# EAGLE design WirelessI2cController (EAGLE 6.6.0)

## Sheet 1 of 6: USB interface
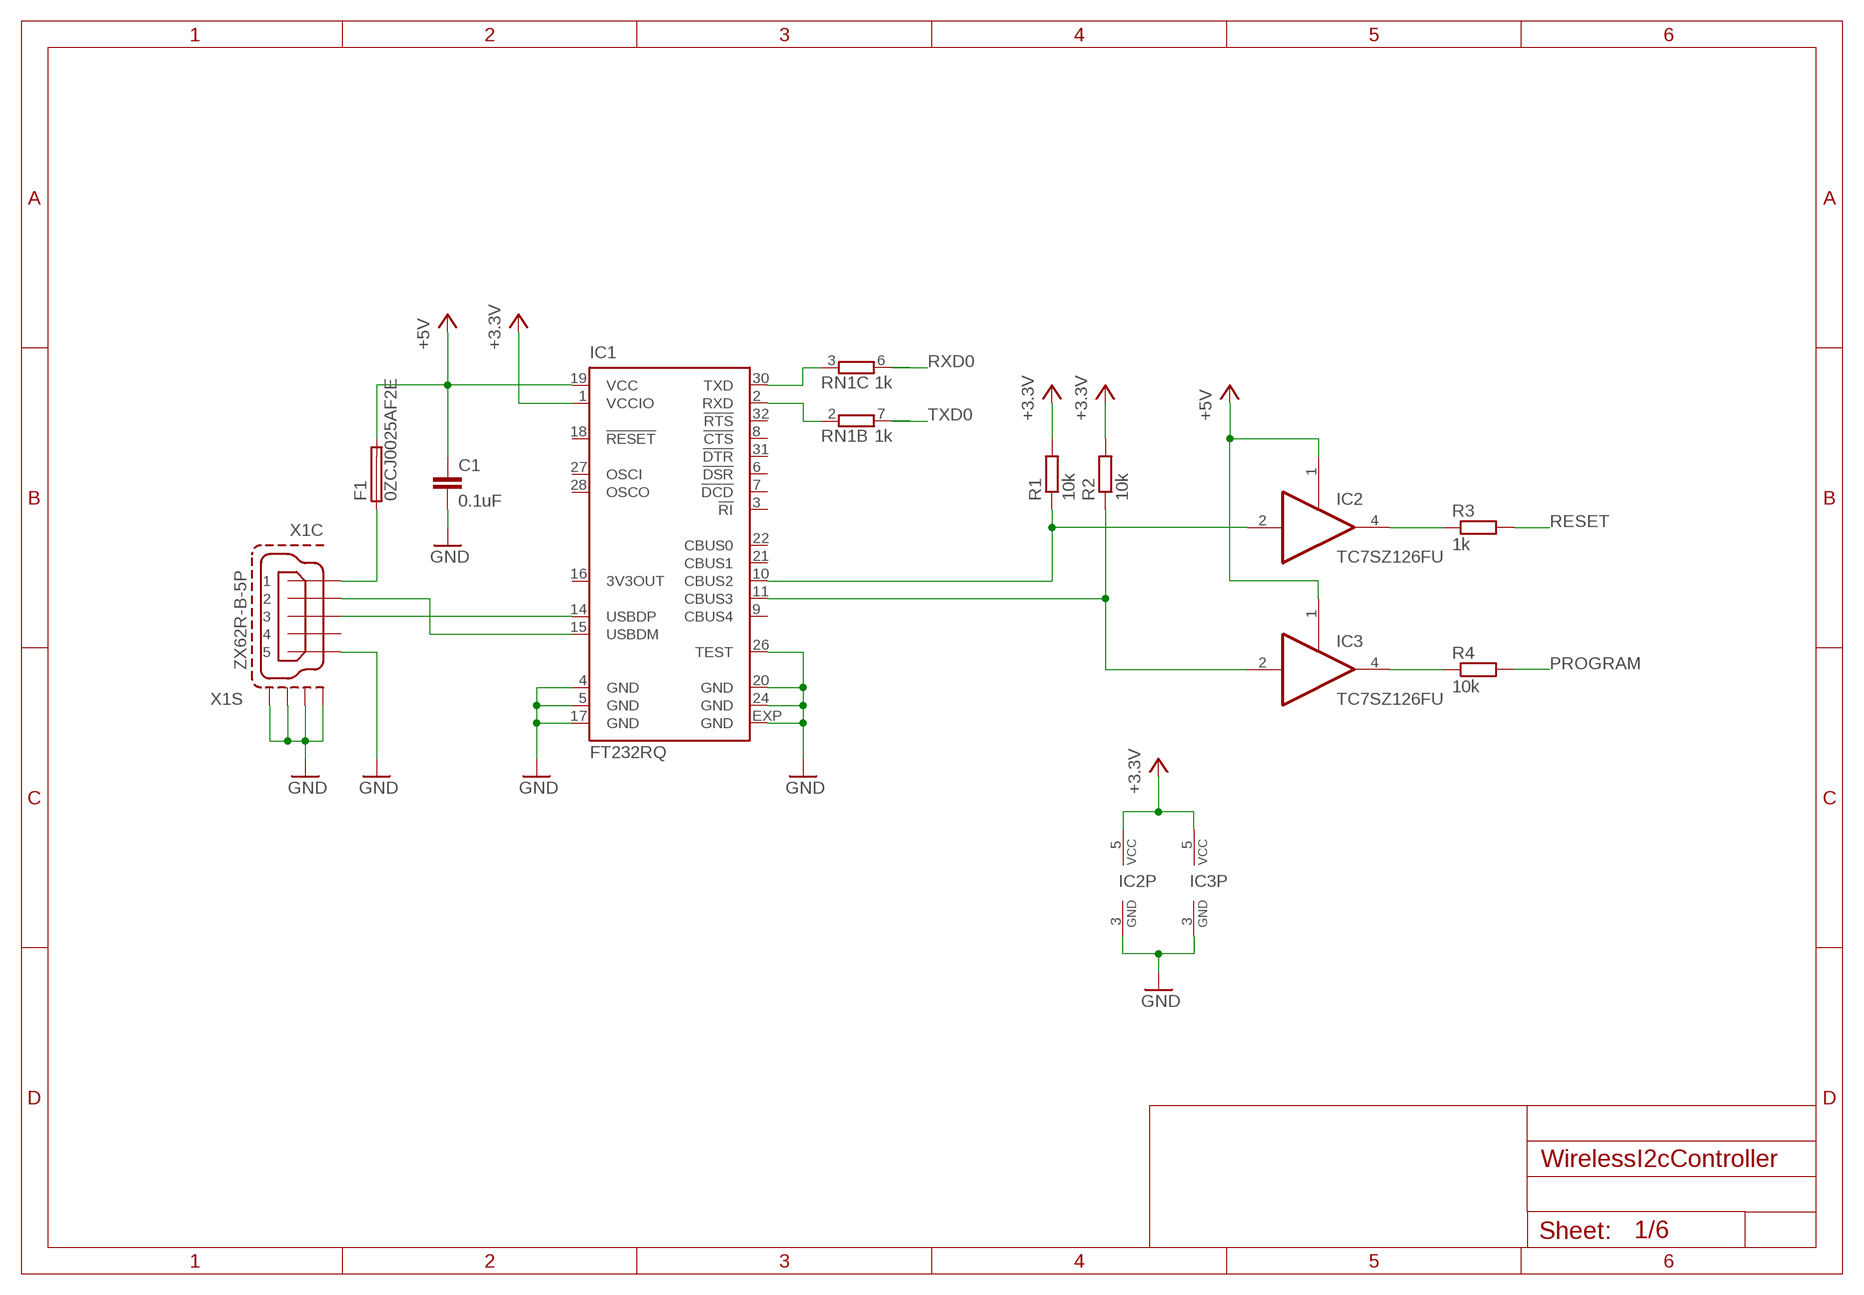
[diagram p0: schematic, sheet 1]

### Parts
C1  0.1uF  C-EUC0402  [C0402]
F1  0ZCJ0025AF2E  [0ZCJ]
IC1  FT232RQ  [QFN32]
IC2  TC7SZ126FU  74LVC1G126DCK  [SC70-5]
IC3  TC7SZ126FU  74LVC1G126DCK  [SC70-5]
R1  10k  R-EU_R0402  [R0402]
R2  10k  R-EU_R0402  [R0402]
R3  1k  R-EU_R0402  [R0402]
R4  10k  R-EU_R0402  [R0402]
RN1  1k  4R-NEXB38V  [EXB38V]
X1  ZX62R-B-5P  [ZX62R-B-5P]

### Nets
+3.3V: IC1.1(VCCIO) IC2.5(VCC) IC3.5(VCC) R1.2 R2.2 ; also sheet 2,3,4,5
+5V: C1.1 F1.2 IC1.19(VCC) IC2.1(OE) IC3.1(OE)
GND: C1.2 IC1.4(GND) IC1.5(GND) IC1.17(GND) IC1.20(GND) IC1.24(GND) IC1.26(TEST) IC1.EXP(GND) IC2.3(GND) IC3.3(GND) X1.5 X1.S1(S:S1) X1.S2(S:S2) X1.S3(S:S3) X1.S4(S:S4) ; also sheet 2,3,4,5,6
N$4: IC1.14(USBDP) X1.3
N$5: IC1.15(USBDM) X1.2
N$9: F1.1 X1.1
N$10: IC1.10(CBUS2) IC2.2(I) R1.1
N$11: IC1.11(CBUS3) IC3.2(I) R2.1
N$12: IC2.4(O) R3.1
N$13: IC3.4(O) R4.1
N$42: IC1.30(TXD) RN1.3
N$43: IC1.2(RXD) RN1.2
PROGRAM: R4.2 ; also sheet 2
RESET: R3.2 ; also sheet 2
RXD0: RN1.6 ; also sheet 2
TXD0: RN1.7 ; also sheet 2
Unconnected: IC1.3(!RI) IC1.6(!DSR) IC1.7(!DCD) IC1.8(!CTS) IC1.9(CBUS4) IC1.16(3V3OUT) IC1.18(!RESET) IC1.21(CBUS1) IC1.22(CBUS0) IC1.27(OSCI) IC1.28(OSCO) IC1.31(!DTR) IC1.32(!RTS) RN1.1 RN1.4 RN1.5 RN1.8 X1.4

## Sheet 2 of 6: 2.4GHz Wireless controller
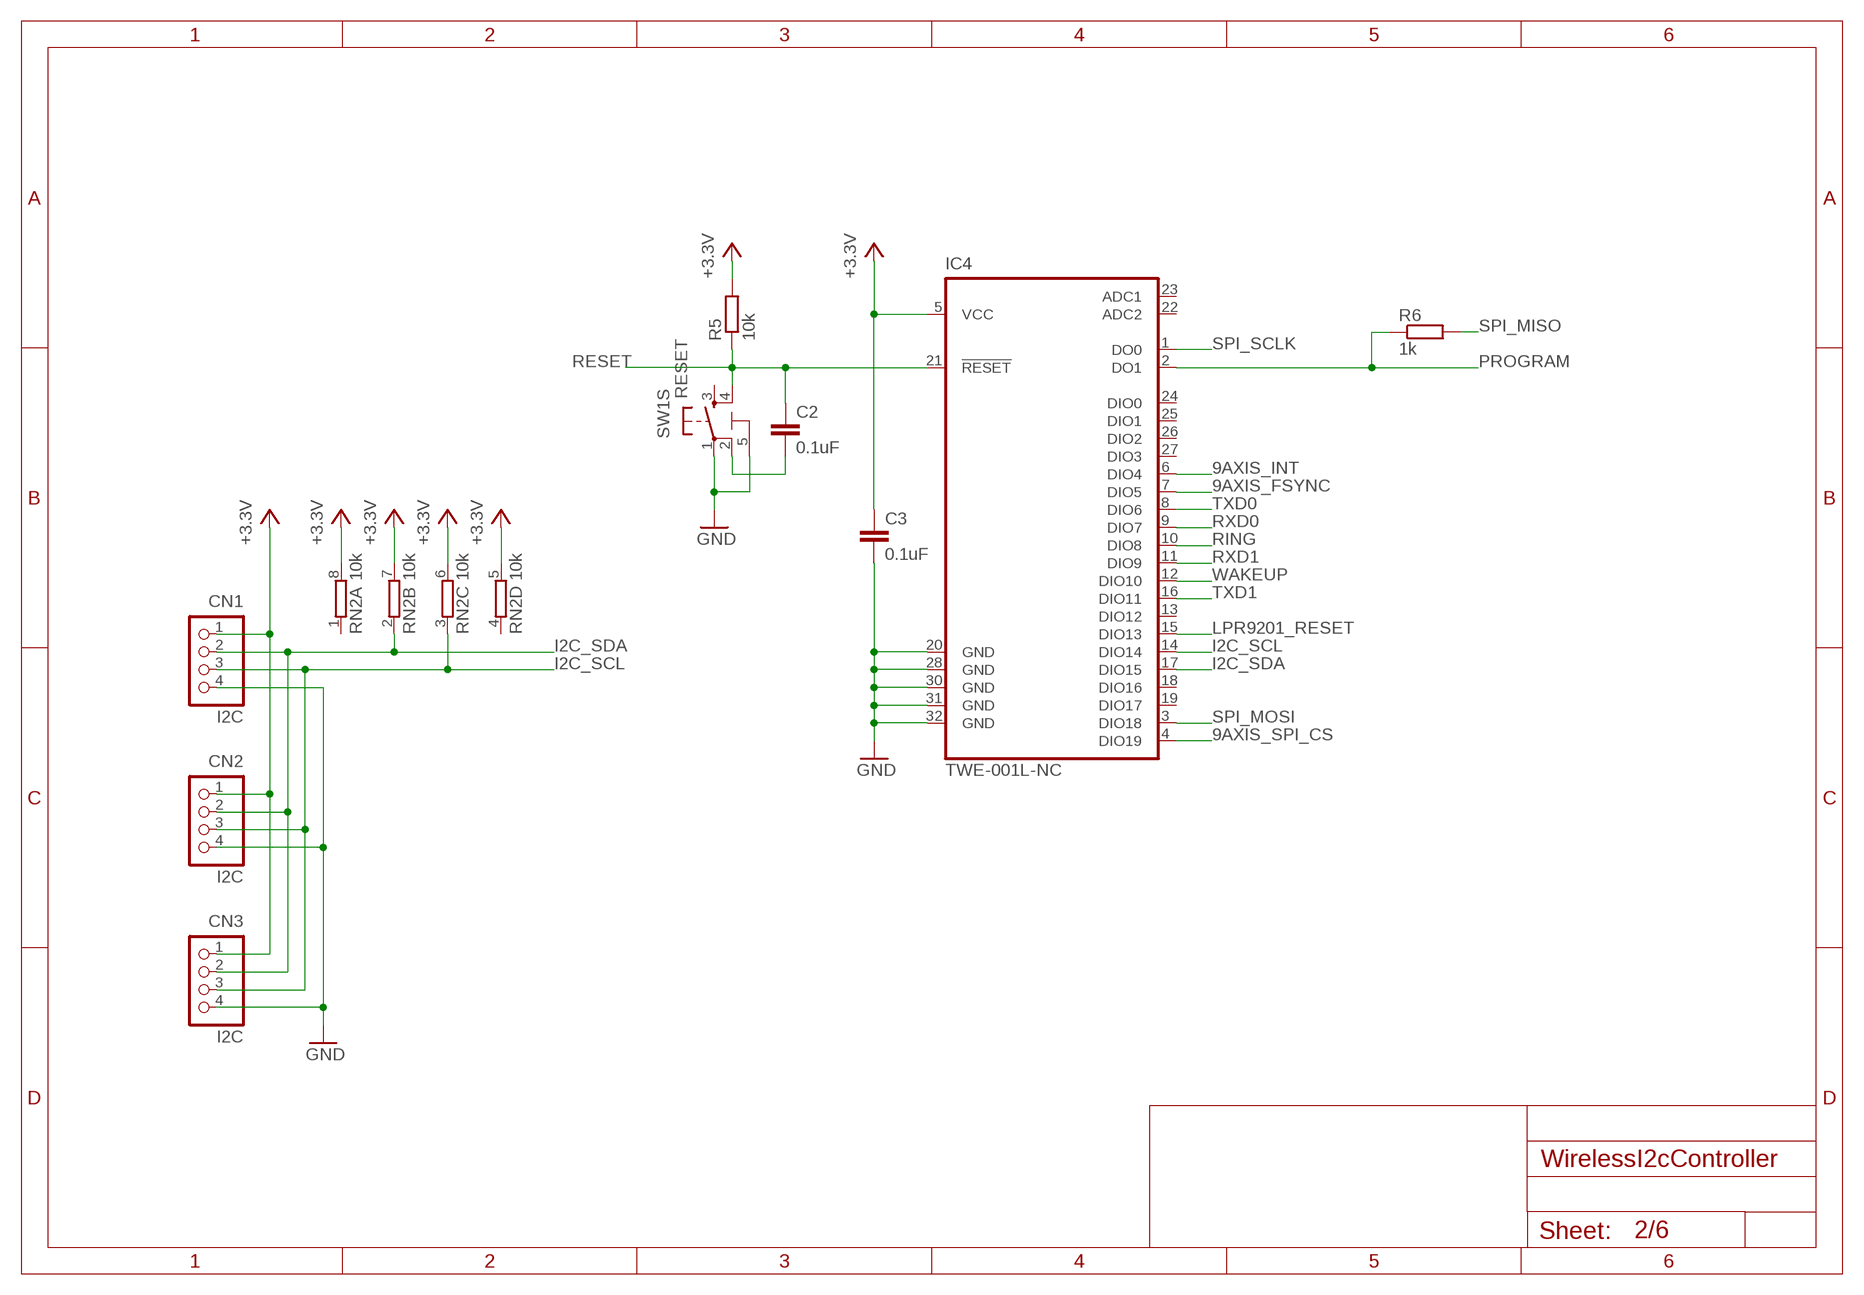
[diagram p1: schematic, sheet 2]

### Parts
C2  0.1uF  C-EUC0402  [C0402]
C3  0.1uF  C-EUC0402  [C0402]
CN1  I2C  B4B-PH-K-S  [B4B-PH-K-S]
CN2  I2C  B4B-PH-K-S  [B4B-PH-K-S]
CN3  I2C  B4B-PH-K-S  [B4B-PH-K-S]
IC4  TWE-001L-NC  [QFN32-HOLE]
R5  10k  R-EU_R0402  [R0402]
R6  1k  R-EU_R0402  [R0402]
RN2  10k  4R-NEXB38V  [EXB38V]
SW1  RESET  KMR241G  [KMR2*G*]

### Nets
9AXIS_FSYNC: IC4.7(DIO5) ; also sheet 4
9AXIS_INT: IC4.6(DIO4) ; also sheet 4
9AXIS_SPI_CS: IC4.4(DIO19) ; also sheet 4
+3.3V: C3.1 CN1.1 CN2.1 CN3.1 IC4.5(VCC) R5.2 RN2.5 RN2.6 RN2.7 RN2.8 ; also sheet 1,3,4,5
GND: C3.2 CN1.4 CN2.4 CN3.4 IC4.20(GND) IC4.28(GND) IC4.30(GND) IC4.31(GND) IC4.32(GND) SW1.1(S:P) SW1.5 ; also sheet 1,3,4,5,6
I2C_SCL: CN1.3 CN2.3 CN3.3 IC4.14(DIO14) RN2.3 ; also sheet 4
I2C_SDA: CN1.2 CN2.2 CN3.2 IC4.17(DIO15) RN2.2 ; also sheet 4
LPR9201_RESET: IC4.15(DIO13) ; also sheet 3
N$6: C2.2 SW1.2(S:P1)
PROGRAM: IC4.2(DO1) R6.1 ; also sheet 1
RESET: C2.1 IC4.21(!RESET) R5.1 SW1.4(S:S1) ; also sheet 1
RING: IC4.10(DIO8) ; also sheet 3
RXD0: IC4.9(DIO7) ; also sheet 1
RXD1: IC4.11(DIO9) ; also sheet 3
SPI_MISO: R6.2 ; also sheet 4
SPI_MOSI: IC4.3(DIO18) ; also sheet 4
SPI_SCLK: IC4.1(DO0) ; also sheet 4
TXD0: IC4.8(DIO6) ; also sheet 1
TXD1: IC4.16(DIO11) ; also sheet 3
WAKEUP: IC4.12(DIO10) ; also sheet 3
Unconnected: IC4.13(DIO12) IC4.18(DIO16) IC4.19(DIO17) IC4.22(ADC2) IC4.23(ADC1) IC4.24(DIO0) IC4.25(DIO1) IC4.26(DIO2) IC4.27(DIO3) RN2.1 RN2.4 SW1.3(S:S)

## Sheet 3 of 6: 920MHz Wireless controller
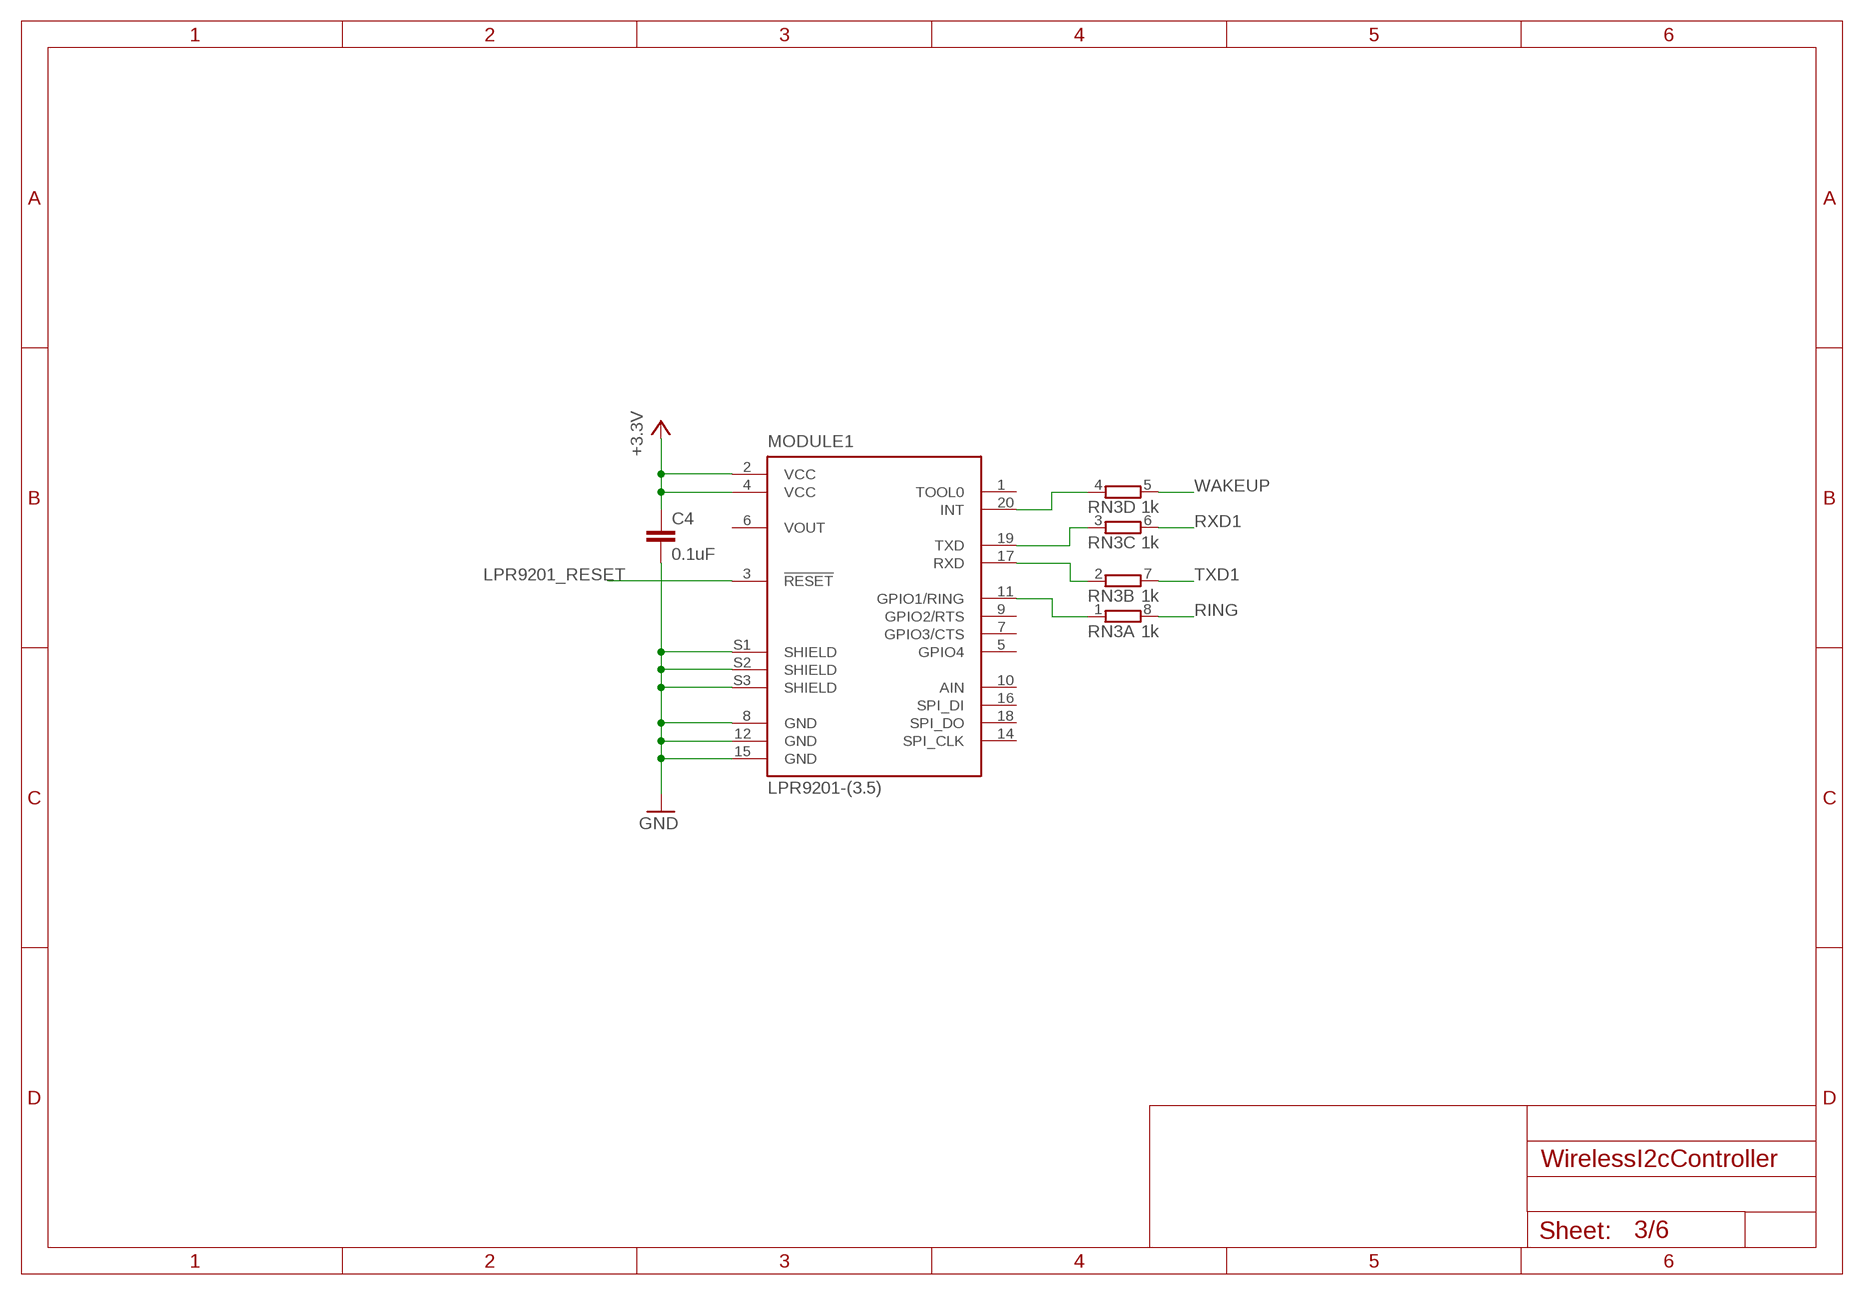
[diagram p2: schematic, sheet 3]

### Parts
C4  0.1uF  C-EUC0402  [C0402]
MODULE1  LPR9201-(3.5)  [DF12(*)-20DP-0.5V]
RN3  1k  4R-NEXB38V  [EXB38V]

### Nets
+3.3V: C4.1 MODULE1.2(VCC) MODULE1.4(VCC) ; also sheet 1,2,4,5
GND: C4.2 MODULE1.8(GND) MODULE1.12(GND) MODULE1.15(GND) MODULE1.S1(SHIELD) MODULE1.S2(SHIELD) MODULE1.S3(SHIELD) ; also sheet 1,2,4,5,6
LPR9201_RESET: MODULE1.3(!RESET) ; also sheet 2
N$3: MODULE1.19(TXD) RN3.3
N$7: MODULE1.17(RXD) RN3.2
N$16: MODULE1.20(INT) RN3.4
N$17: MODULE1.11(GPIO1/RING) RN3.1
RING: RN3.8 ; also sheet 2
RXD1: RN3.6 ; also sheet 2
TXD1: RN3.7 ; also sheet 2
WAKEUP: RN3.5 ; also sheet 2
Unconnected: MODULE1.1(TOOL0) MODULE1.5(GPIO4) MODULE1.6(VOUT) MODULE1.7(GPIO3/CTS) MODULE1.9(GPIO2/RTS) MODULE1.10(AIN) MODULE1.14(SPI_CLK) MODULE1.16(SPI_DI) MODULE1.18(SPI_DO)

## Sheet 4 of 6: Sensor
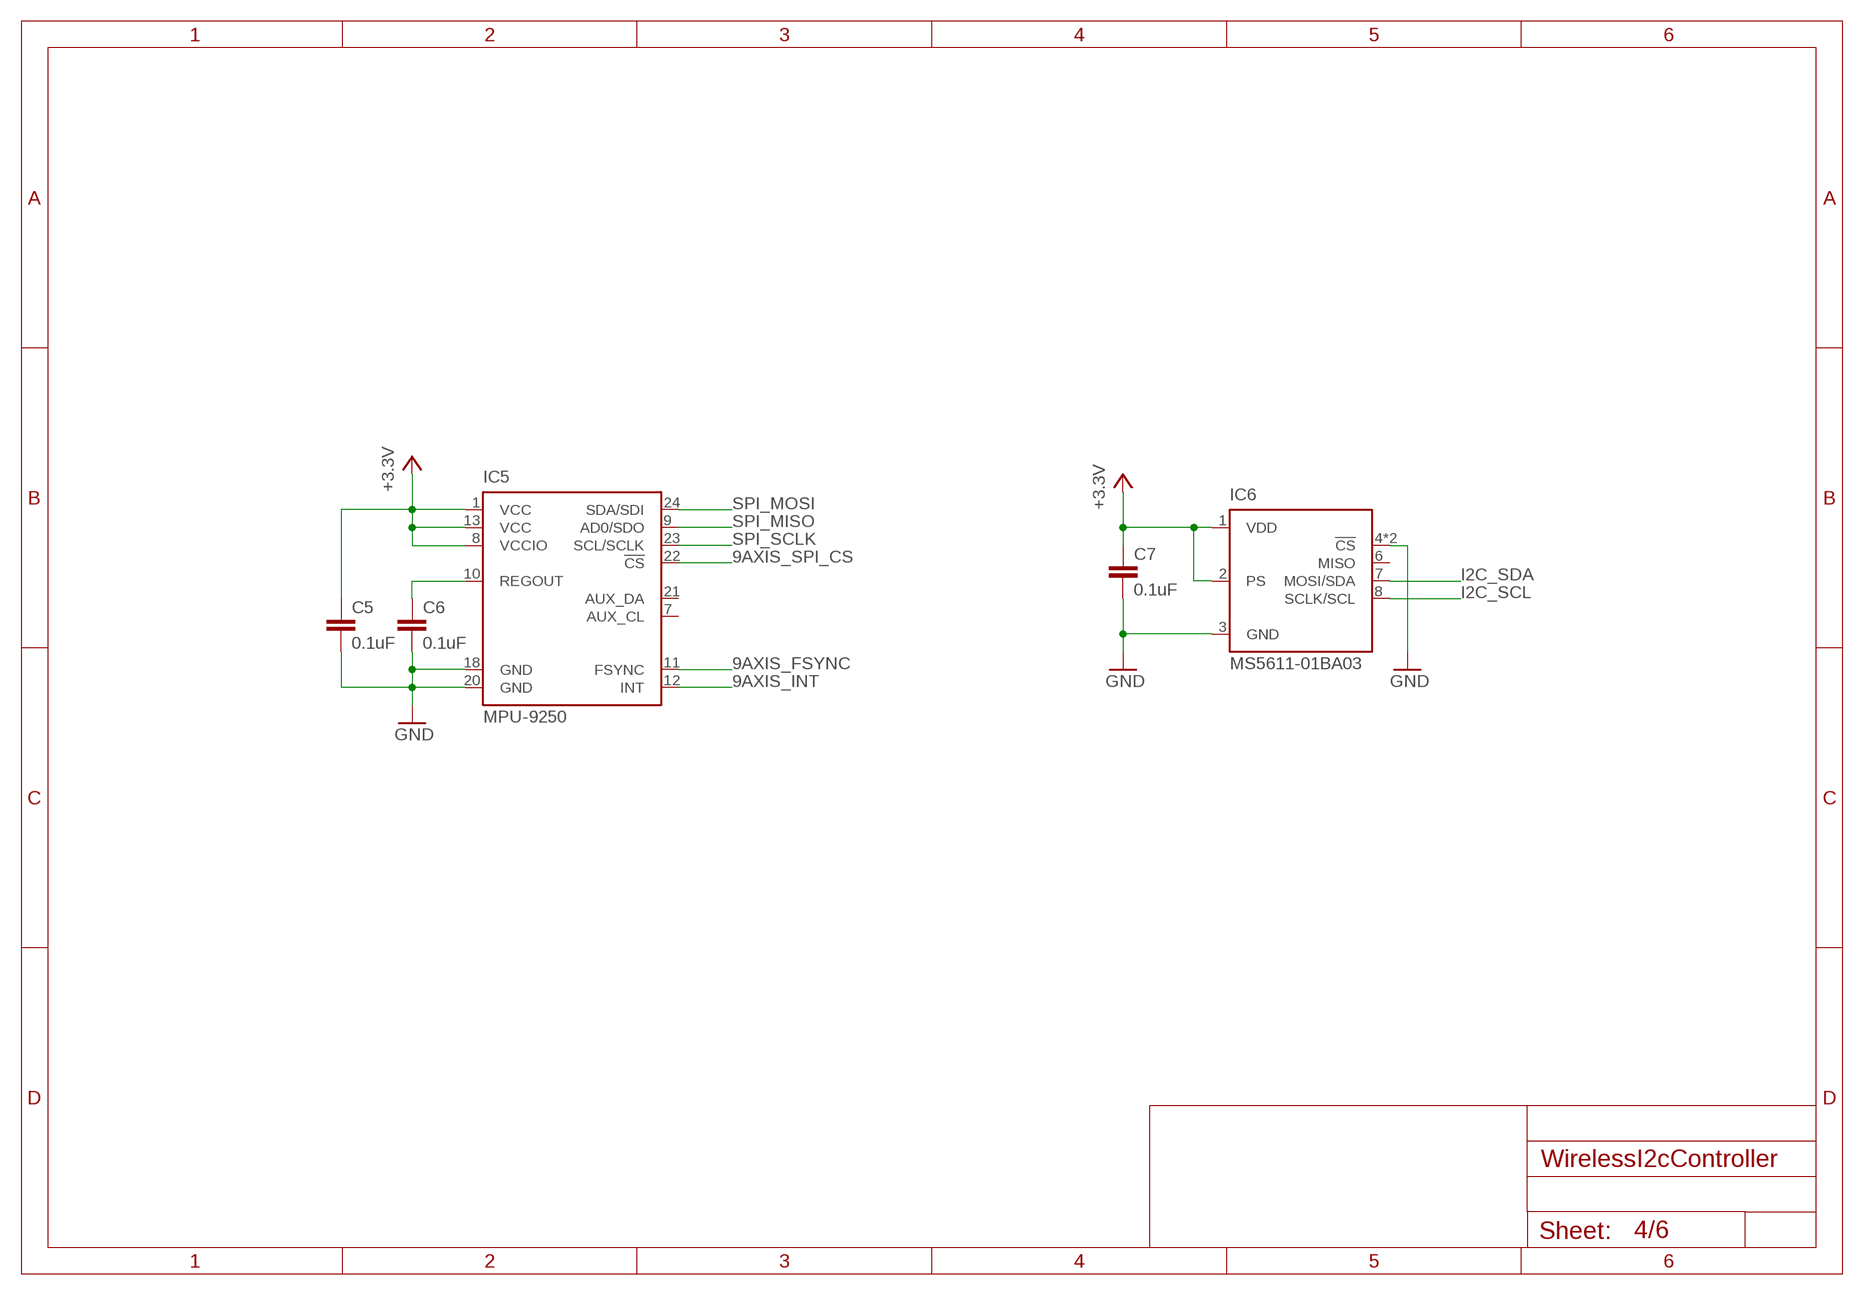
[diagram p3: schematic, sheet 4]

### Parts
C5  0.1uF  C-EUC0402  [C0402]
C6  0.1uF  C-EUC0402  [C0402]
C7  0.1uF  C-EUC0402  [C0402]
IC5  MPU-9250  [QFN24-SMALL]
IC6  MS5611-01BA03  [LGA8]

### Nets
9AXIS_FSYNC: IC5.11(FSYNC) ; also sheet 2
9AXIS_INT: IC5.12(INT) ; also sheet 2
9AXIS_SPI_CS: IC5.22(!CS) ; also sheet 2
+3.3V: C5.1 C7.1 IC5.1(VCC) IC5.8(VCCIO) IC5.13(VCC) IC6.1(VDD) IC6.2(PS) ; also sheet 1,2,3,5
GND: C5.2 C6.2 C7.2 IC5.18(GND) IC5.20(GND) IC6.3(GND) IC6.4(!CS!) IC6.5(!CS!) ; also sheet 1,2,3,5,6
I2C_SCL: IC6.8(SCLK/SCL) ; also sheet 2
I2C_SDA: IC6.7(MOSI/SDA) ; also sheet 2
N$1: C6.1 IC5.10(REGOUT)
SPI_MISO: IC5.9(AD0/SDO) ; also sheet 2
SPI_MOSI: IC5.24(SDA/SDI) ; also sheet 2
SPI_SCLK: IC5.23(SCL/SCLK) ; also sheet 2
Unconnected: IC5.7(AUX_CL) IC5.21(AUX_DA) IC6.6(MISO)

## Sheet 5 of 6: Power Supply
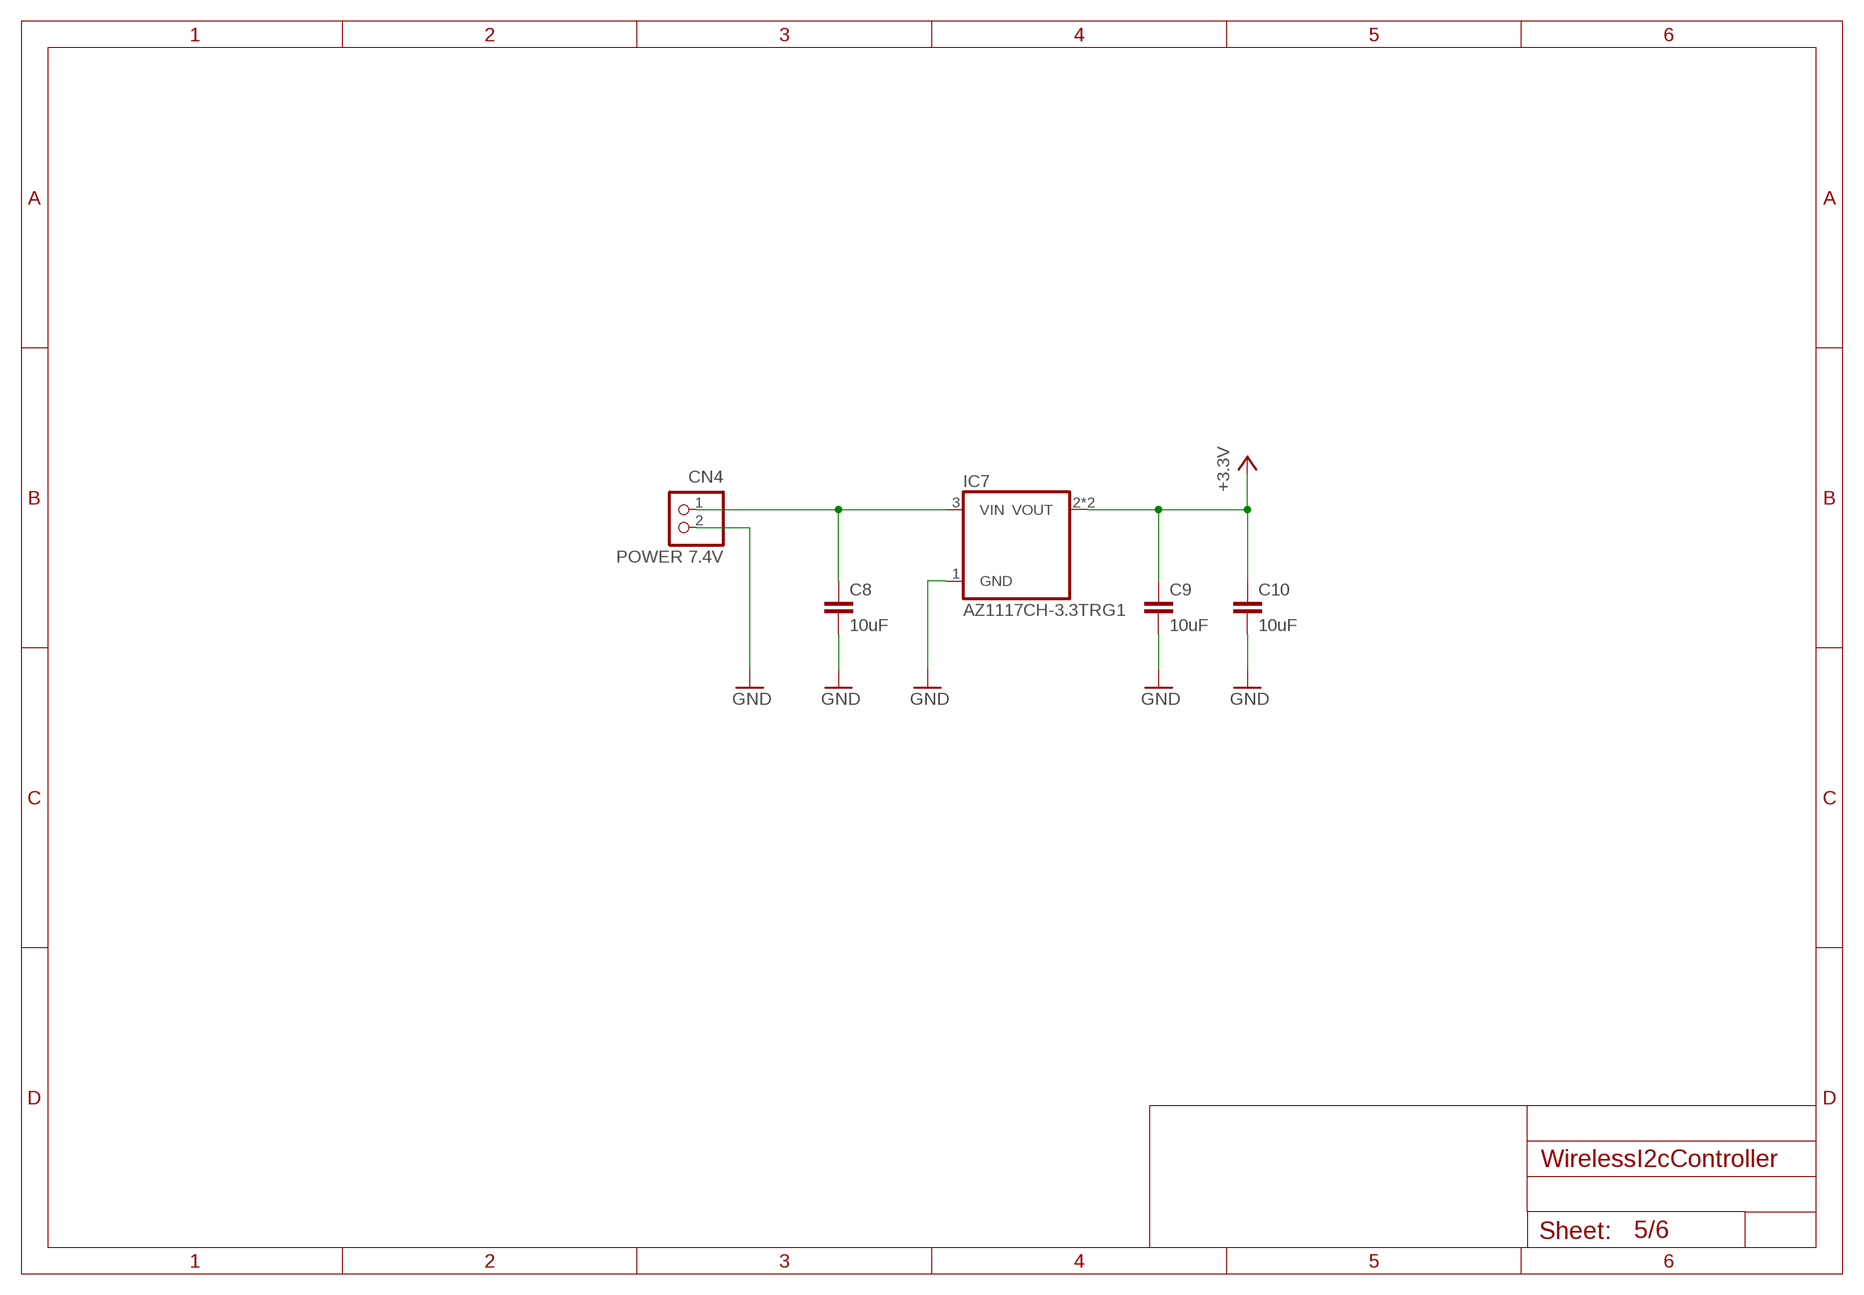
[diagram p4: schematic, sheet 5]

### Parts
C8  10uF  C-EUC0805  [C0805]
C9  10uF  C-EUC0805  [C0805]
C10  10uF  C-EUC0805  [C0805]
CN4  POWER 7.4V  S2B-PH-K-S  [S2B-PH-K-S]
IC7  AZ1117CH-3.3TRG1  [SOT223]

### Nets
+3.3V: C9.1 C10.1 IC7.2(VOUT) IC7.4(VOUT) ; also sheet 1,2,3,4
GND: C8.2 C9.2 C10.2 CN4.2 IC7.1(GND) ; also sheet 1,2,3,4,6
N$14: C8.1 CN4.1 IC7.3(VIN)

## Sheet 6 of 6: Mount Holes
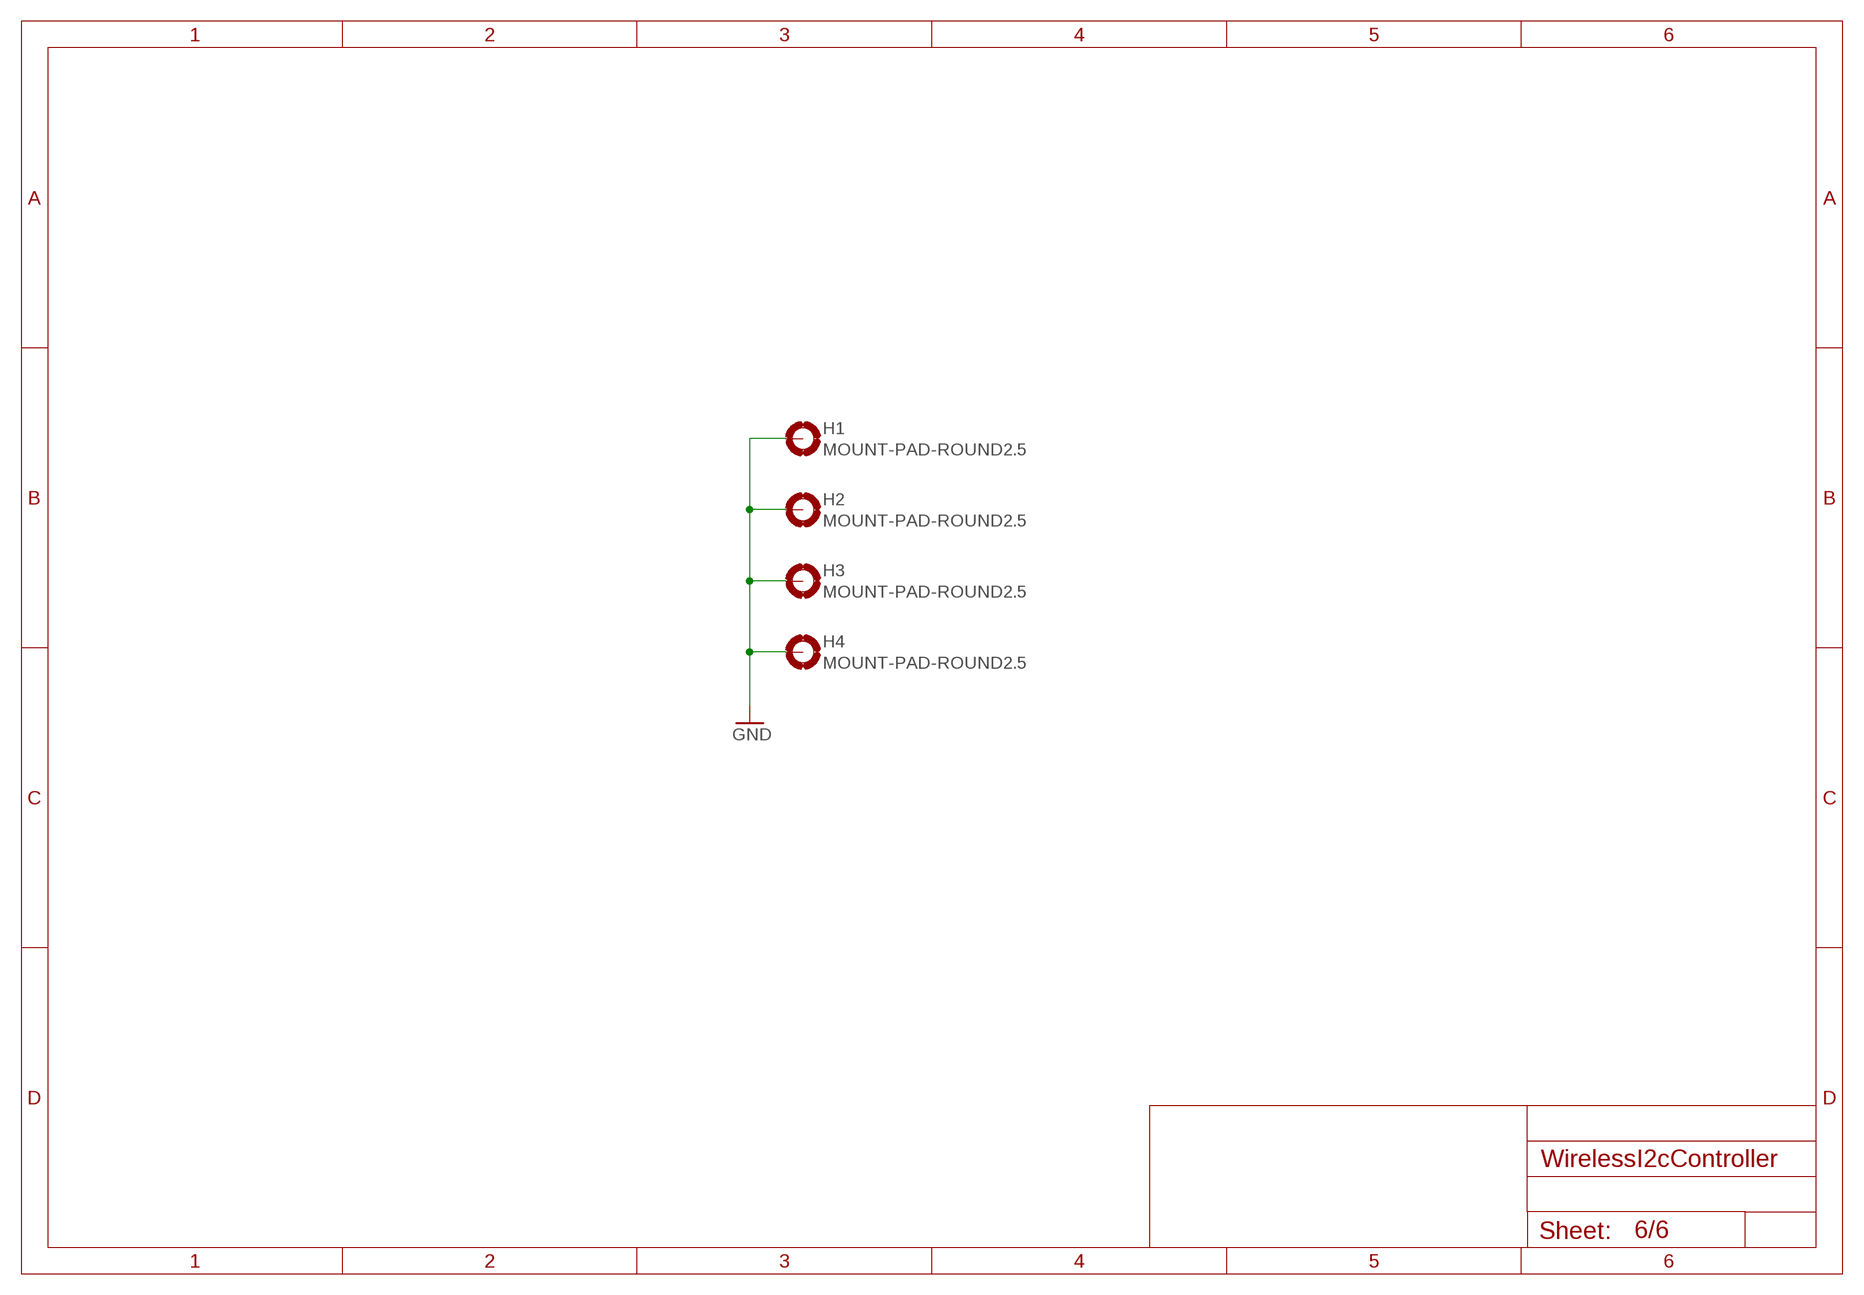
[diagram p5: schematic, sheet 6]

### Parts
H1  MOUNT-PAD-ROUND2.5  [2,5-PAD]
H2  MOUNT-PAD-ROUND2.5  [2,5-PAD]
H3  MOUNT-PAD-ROUND2.5  [2,5-PAD]
H4  MOUNT-PAD-ROUND2.5  [2,5-PAD]

### Nets
GND: H1.B2,5(MOUNT) H2.B2,5(MOUNT) H3.B2,5(MOUNT) H4.B2,5(MOUNT) ; also sheet 1,2,3,4,5

## Library data of the parts
C1-C10 = resistor:C-EU: CAPACITOR, European symbol
CN1-CN3 = jst-ph:B4B-PH-*: Wire-to-Board 2.0mm pitch top mount connector Source: http://www.jst-mfg.com/product/pdf/jpn/PH.pdf http://www.jst-mfg.com/product/detail.php?series=199
CN4 = jst-ph:S2B-PH-*: Wire-to-Board 2.0mm pitch side mount connector Source: http://www.jst-mfg.com/product/pdf/jpn/PH.pdf http://www.jst-mfg.com/product/detail.php?series=199
F1 = bel-fuse:0ZCJ*: Surface Mount PTC 0ZCJ Series Source: http://www.belfuse.com/pdfs/0ZCJ.pdf
H1-H4 = holes:MOUNT-PAD-ROUND: MOUNTING PAD, round
IC1 = ftdichip:FT232R: Source: http://www.ftdichip.com/Documents/DataSheets/DS_FT232R_v104.pdf
IC2 IC3 = 74xx-little-us:74*1G126: Single Bus Buffer Gate With 3-State Outputs
IC4 = tocos:TWE-001L*: ZigBee 2.4GHz Wireless transceiver module Source: http://tocos-wireless.com/files/datasheet/TWD-PDS-TWE001L-JP-1.30.pdf
IC5 = invensense:MPU-9250: 9-axis MotionTracking device communicate with I2C/SPI Source: http://www.invensense.com/mems/gyro/documents/PS-MPU-9250A-01.pdf
IC6 = measurement-specialties:MS5611-01BA03: Barometric Pressure Sensor, with stainless steel cap Source: http://www.meas-spec.com/downloads/MS5611-01BA03.pdf
IC7 = diodes:AZ1117CH-3.3TRG1: 1A LDO Voltage Regulator with Enable Source: http://www.diodes.com/datasheets/AZ1117C.pdf
MODULE1 = satori:LPR9201-(*): 920MHz Wireless transceiver module Mount holes using MAC8 TH-1.6-*-M2 * depend on connector height 3.0 - 5.0
R1-R6 = resistor:R-EU_: RESISTOR, European symbol
RN1-RN3 = resistor-dil:4R-N: Array Chip Resistor Source: RS Component / Phycomp; OC_FARNELL: unknown; OC_NEWARK: unknown
SW1 = c-and-k-components-kmr-series:KMR2*G
X1 = hirose-zx:ZX62R-B-5P: Micro USB Connector HI-SPEED Certified Source: https://www.hirose.co.jp/catalogj_hp/jd_ZX_20140305.pdf

## Board
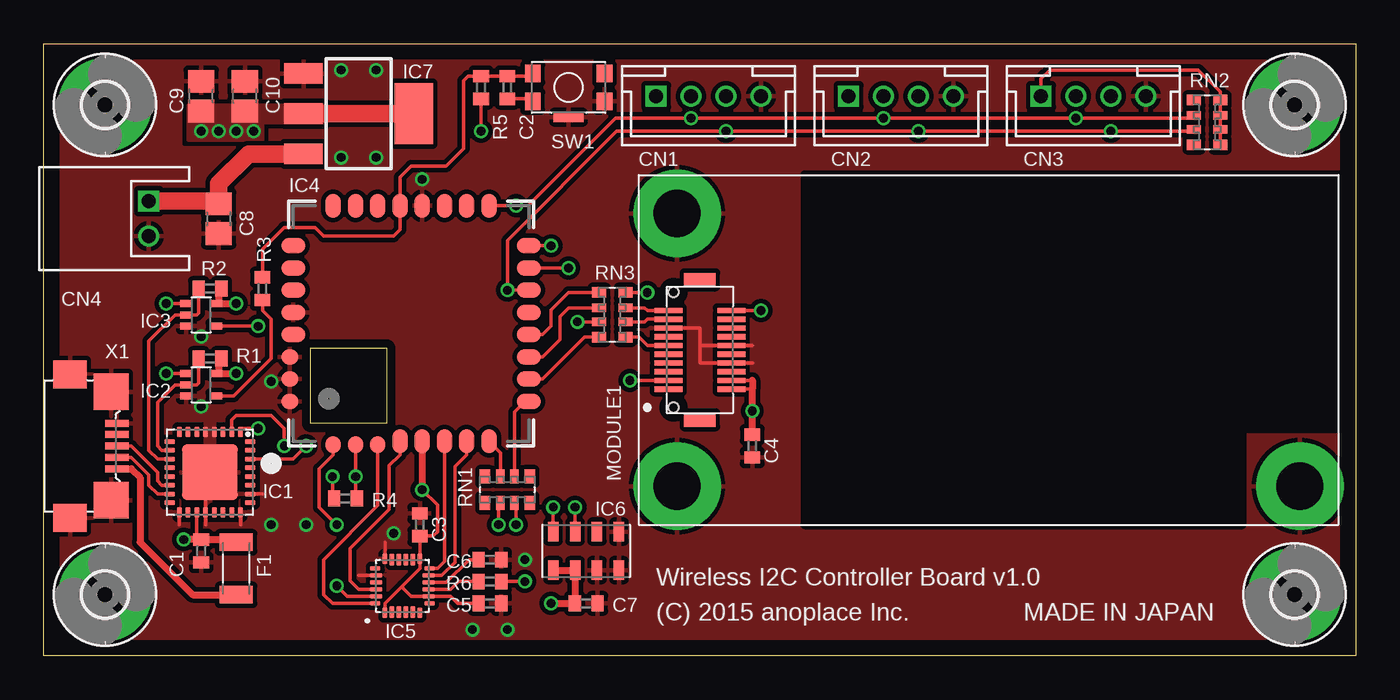
[diagram p6: board, top side]
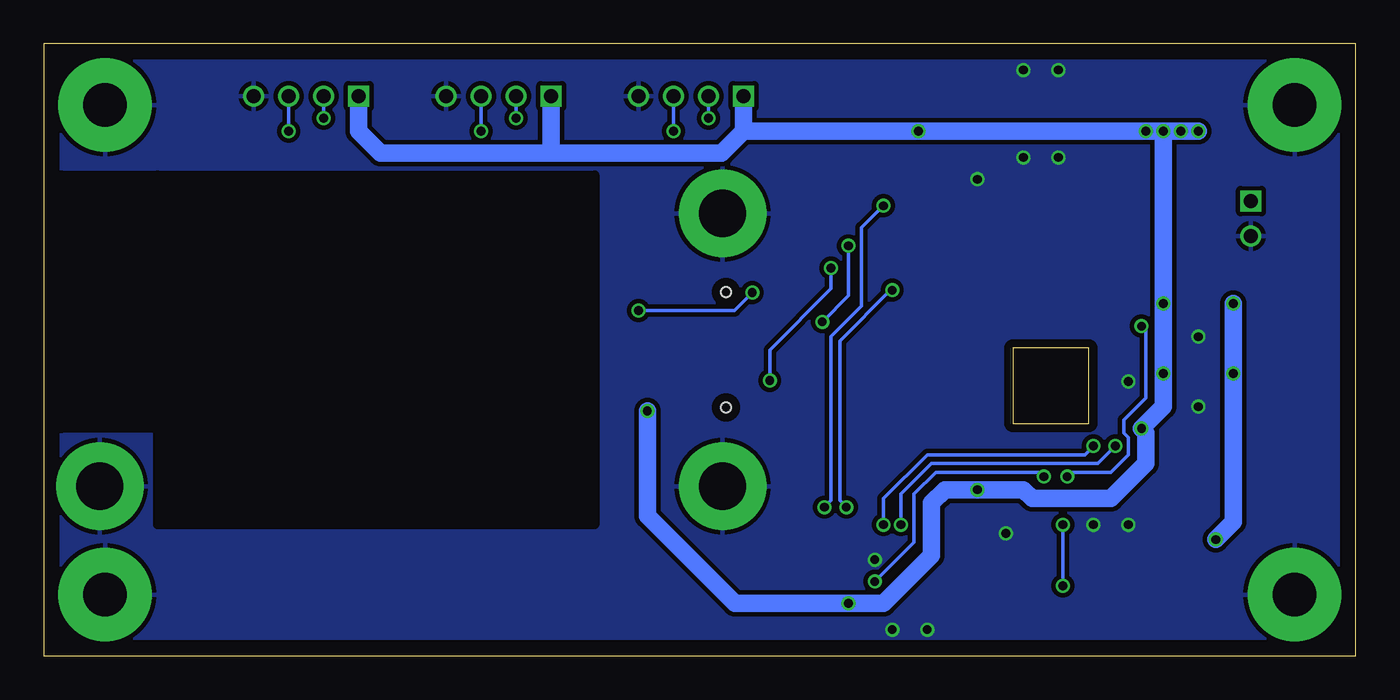
[diagram p7: board, bottom side, seen from below]

Size 75 x 35 mm. Coordinates in mm from the lower left corner, seen from the top.
Outline: 0,35 75,35 75,0 0,0 0,35
Copper layers (1+2*15+16): Top 0.018mm / dielectric 0.25mm / Route2 0.035mm / dielectric 1mm / Route15 0.035mm / dielectric 0.25mm / Bottom 0.018mm
Design rules "pban_5mil-l4": minimum track width 5mil, minimum drill 0.3mm, track to track 5mil, track to pad 0.229mm, pad to pad 5mil, via to via 5mil, smd to smd 5mil, copper to edge 0.5mm, drill to drill 0.5mm, minimum pad ring 0.15mm, minimum via ring 0.15mm, stop-mask expansion 4mil, vias tented up to drill 0.35mm, thermal gap 10mil
tRestrict: area 13,19.5 to 13.2,19.8

### Footprints (pad centres in the part's own frame; a part is rotated, then mirrored left to right if it is on the bottom)
C0402 = smd 0.7 x 0.9: 1 -0.65,0; 2 0.65,0
C0805 = smd 1.3 x 1.5: 1 -0.85,0; 2 0.85,0
B4B-PH-K-S = drill 0.8 square: 1 -3,0 | drill 0.8: 2 -1,0; 3 1,0; 4 3,0
S2B-PH-K-S = drill 0.8 square: 1 1,0 | drill 0.8: 2 -1,0
0ZCJ = smd 1 x 1.9: 1 -1.5,0; 2 1.5,0
2,5-PAD = drill 2.5 pad 5.334: B2,5 0,0
QFN32 = smd 0.6 x 0.3: 1 -2.3,1.75; 2 -2.3,1.25; 3 -2.3,0.75; 4 -2.3,0.25; 5 -2.3,-0.25; 6 -2.3,-0.75; 7 -2.3,-1.25; 8 -2.3,-1.75; 17 2.3,-1.75; 18 2.3,-1.25; 19 2.3,-0.75; 20 2.3,-0.25; 21 2.3,0.25; 22 2.3,0.75; 23 2.3,1.25; 24 2.3,1.75 | smd 0.3 x 0.6: 9 -1.75,-2.3; 10 -1.25,-2.3; 11 -0.75,-2.3; 12 -0.25,-2.3; 13 0.25,-2.3; 14 0.75,-2.3; 15 1.25,-2.3; 16 1.75,-2.3; 25 1.75,2.3; 26 1.25,2.3; 27 0.75,2.3; 28 0.25,2.3; 29 -0.25,2.3; 30 -0.75,2.3; 31 -1.25,2.3; 32 -1.75,2.3 | smd 3.2 x 3.2: EXP 0,0
SC70-5 = smd 0.4 x 0.7: 1 -0.65,-0.85; 2 0,-0.85; 3 0.65,-0.85; 4 0.65,0.85; 5 -0.65,0.85
QFN32-HOLE = smd 1 x 0.9: 1 -6.935,4.445; 2 -6.935,3.175; 3 -6.935,1.905 | smd 1.4 x 0.9: 4 -6.735,0.635; 5 -6.735,-0.635; 6 -6.735,-1.905; 7 -6.735,-3.175; 8 -6.735,-4.445; 17 6.735,-4.445; 18 6.735,-3.175; 19 6.735,-1.905; 20 6.735,-0.635; 21 6.735,0.635; 22 6.735,1.905; 23 6.735,3.175; 24 6.735,4.445 | smd 0.9 x 1.4: 9 -4.445,-6.735; 10 -3.175,-6.735; 11 -1.905,-6.735; 12 -0.635,-6.735; 13 0.635,-6.735; 14 1.905,-6.735; 15 3.175,-6.735; 16 4.445,-6.735; 25 4.445,6.735; 26 3.175,6.735; 27 1.905,6.735; 28 0.635,6.735; 29 -0.635,6.735 | smd 0.9 x 1: 30 -1.905,6.935; 31 -3.175,6.935; 32 -4.445,6.935
QFN24-SMALL = smd 0.6 x 0.25: 1 -1.55,1; 6 -1.55,-1; 13 1.55,-1; 18 1.55,1 | smd 0.7 x 0.25: 2 -1.5,0.6; 3 -1.5,0.2; 4 -1.5,-0.2; 5 -1.5,-0.6; 14 1.5,-0.6; 15 1.5,-0.2; 16 1.5,0.2; 17 1.5,0.6 | smd 0.25 x 0.6: 7 -1,-1.55; 12 1,-1.55; 19 1,1.55; 24 -1,1.55 | smd 0.25 x 0.7: 8 -0.6,-1.5; 9 -0.2,-1.5; 10 0.2,-1.5; 11 0.6,-1.5; 20 0.6,1.5; 21 0.2,1.5; 22 -0.2,1.5; 23 -0.6,1.5
LGA8 = smd 1.1 x 0.6: 1 -1.1,1.875; 2 -1.1,0.625; 3 -1.1,-0.625; 4 -1.1,-1.875; 5 1.1,-1.875; 6 1.1,-0.625; 7 1.1,0.625; 8 1.1,1.875
SOT223 = smd 1.2 x 2.2: 1 -2.3,-3.15; 2 0,-3.15; 3 2.3,-3.15 | smd 3.5 x 2.2: 4 0,3.15
DF12(*)-20DP-0.5V = smd 1.6 x 0.3: 1 1.8,2.25; 2 -1.8,2.25; 3 1.8,1.75; 4 -1.8,1.75; 5 1.8,1.25; 6 -1.8,1.25; 7 1.8,0.75; 8 -1.8,0.75; 9 1.8,0.25; 10 -1.8,0.25; 11 1.8,-0.25; 12 -1.8,-0.25; 13 1.8,-0.75; 14 -1.8,-0.75; 15 1.8,-1.25; 16 -1.8,-1.25; 17 1.8,-1.75; 18 -1.8,-1.75; 19 1.8,-2.25; 20 -1.8,-2.25 | smd 1.8 x 0.8: HOLD@1 0,4; HOLD@2 0,-4 | drill 2.7 pad 5: S1 1.3,7.8; S2 1.3,-7.8; S3 -34.3,7.8 | hole 0.6: 1.5,3.3; 1.5,-3.3
R0402 = smd 0.7 x 0.9: 1 -0.65,0; 2 0.65,0
EXB38V = smd 0.6 x 0.8: 1 -1.275,-0.75; 4 1.275,-0.75; 5 1.275,0.75; 8 -1.275,0.75 | smd 0.5 x 0.8: 2 -0.4,-0.75; 3 0.4,-0.75; 6 0.4,0.75; 7 -0.4,0.75
KMR2*G* = smd 0.9 x 1: 1 -2.05,0.8; 2 2.05,0.8; 3 -2.05,-0.8; 4 2.05,-0.8 | smd 1.7 x 0.55: 5 0,1.7
ZX62R-B-5P = smd 1.35 x 0.4: 1 2.675,-1.3; 2 2.675,-0.65; 3 2.675,0; 4 2.675,0.65; 5 2.675,1.3 | smd 1.9 x 1.6: S1 0,-4.1; S2 0,4.1 | smd 2 x 2.1: S3 2.35,3.1; S4 2.35,-3.1

### Placement (x,y rotation side)
C1  9,6 270 top
C2  26.5,32.5 270 top
C3  21.5,7.5 90 top
C4  40.5,12 270 top
C5  25.5,3 0 top
C6  25.5,5.5 0 top
C7  31,3 0 top
C8  10,25 270 top
C9  9,32 90 top
C10  11.5,32 90 top
CN1  38,32 0 top
CN2  49,32 0 top
CN3  60,32 0 top
CN4  6,25 90 top
F1  11,5 90 top
H1  3.5,31.5 0 top
H2  3.5,3.5 0 top
H3  71.5,3.5 0 top
H4  71.5,31.5 0 top
IC1  9.5,10.5 270 top
IC2  9,15.5 270 top
IC3  9,19.5 270 top
IC4  21,19 90 top
IC5  20.5,4 90 top
IC6  31,6 90 top
IC7  18,31 270 top
MODULE1  37.5,17.5 180 top
R1  9.5,17 0 top
R2  9.5,21 0 top
R3  12.5,21 90 top
R4  17.25,9 0 top
R5  25,32.5 270 top
R6  25.5,4.25 180 top
RN1  26.5,9.5 0 top
RN2  66.5,30.5 270 top
RN3  32.5,19.5 90 top
SW1  30,32.5 180 top
X1  1.5,12 0 top

### Tracks (layer width: path | path; a pad name or v marks a point on that pad's centre or on a via)
9AXIS_FSYNC
  Top 0.2: IC5.11 22.75,4.6 23.5,5.35 23.5,10.82 24.18,11.5 IC4.7
9AXIS_INT
  Top 0.2: IC5.12 22.5,5 22.91,5.41 IC4.6
9AXIS_SPI_CS
  Top 0.2: IC5.22 18,3.8 17.5,4.3 17.5,6.13 19.75,8.38 19.75,10.88 20.36,11.5 IC4.4
+3.3V  (via drill 0.5)
  Top 0.2: R2.2 10,21 | IC3.5 10,20.15 | R1.2 10,17 | IC2.5 10,16.15 | 20.5,4 21.5,5 IC5.13 C3.1 22.25,6.85 22.5,7.1 22.5,8.63 v21.64,9.5 | 20.5,4 19.5,3 IC5.1 | 20.5,4 20.5,3.9 21,3.4 IC5.8 23.25,3.4 23.65,3 C5.1 | MODULE1.2 40.5,15.25 | MODULE1.4 40.5,15.75 | IC1.1 11.25,13 v12.25,13 | 30.38,3 C7.1 | CN3.1 57,33 57.5,33.5 66,33.5 67.25,32.25 RN2.8 RN2.7 RN2.6 RN2.5 | R5.2 v25,30
  Top 0.4: 10,21 10,20.15 v11,20.15 | 10,17 10,16.15 v11,16.15 | 40.5,15.75 40.5,15.25 v40.5,14 C4.1 | IC4.5 v21.64,9.5 | 30.38,3 IC6.2 IC6.1 | v29,3 C7.1
  Top 1: IC7.2 IC7.4
  Bottom 1: 35,30 v25,30 v12,30 v11,30 | v11,30 v11,20.15 v11,16.15 11,14.25 v12.25,13 12,12.75 12,11 14,9 18.5,9 19,9.5 v21.64,9.5 23.5,9.5 24.25,8.75 24.25,5.75 27,3 v29,3 35.5,3 40.5,8 v40.5,14 | v11,30 v10,30 v9,30 | CN3.1 57,30 55.75,28.75 46,28.75 | 46,28.75 36.25,28.75 35,30 | CN2.1 46,28.75 | CN1.1 35,30
  pour Top (isolate 0.254, no thermals): 8.25,31.5 16,31.5 16,30.5 12.5,30.5 12.5,29.5 8.25,29.5
+5V  (via drill 0.5)
  Top 0.2: IC3.1 v7,20.15 | IC2.1 v7,16.15 | IC1.19 8.75,6.65 C1.1
  Top 0.4: 8.75,6.65 v8,6.65 | C1.1 11,6.65 F1.2
  Bottom 1: v7,20.15 v7,16.15 7,7.65 v8,6.65
GND  (via drill 0.5)
  Top 0.2: IC5.18 19.5,6.5 | IC5.20 18,4.6 | MODULE1.15 37.5,18.75 37.5,17.75 | 40.5,17.75 MODULE1.12 37.5,17.75 | 40.5,16.75 MODULE1.8 37.5,16.75 37.5,17.75 | 9.25,7.5 IC1.20 9.25,10.25 IC1.EXP | 7.75,7.5 IC1.17 | IC1.24 11.25,7.5 | 12.5,9.25 IC1.26
  other vias: 9,14.25 9,18.25 13,15.69 13,7.5 20,7 17,33.5 19,33.5 17,28.5 19,28.5 21.64,27.25 15,7.5 26.5,1.5 24.5,1.5 27.5,5.5
  pour Top (isolate 0.254, rank 6): 1,34 74,34 74,1 1,1
  pour Bottom (isolate 0.254, rank 6): 1,34 74,34 74,1 1,1
  pour Top (isolate 0.254, rank 6, no thermals): 9.25,14 9.75,14 9.75,12 9.25,12
I2C_SCL  (via drill 0.5)
  Top 0.2: IC4.14 v26.5,20.91 26.5,23.75 32.75,30 v39,30 v50,30 v61,30 65.75,30 RN2.3 | IC6.8 v29.12,8.5
  Bottom 0.2: v39,30 CN1.3 | v50,30 CN2.3 | CN3.3 v61,30 | v29.12,8.5 29.5,8.88 29.5,18 26.59,20.91 v26.5,20.91
I2C_SDA  (via drill 0.5)
  Top 0.2: IC6.7 v30.38,8.5 | IC4.17 v27,25.73 27.68,25.73 32.7,30.75 v37,30.75 v48,30.75 v59,30.75 65.75,30.75 RN2.2
  Bottom 0.2: v37,30.75 CN1.2 | v48,30.75 CN2.2 | CN3.2 v59,30.75 | v30.38,8.5 30,8.88 30,18.25 28.25,20 28.25,24.48 v27,25.73
LPR9201_RESET  (via drill 0.5)
  Top 0.2: MODULE1.3 v33.5,15.75 | IC4.15 v30,22.18
  Bottom 0.2: v33.5,15.75 33.5,17.5 30,21 v30,22.18
N$1
  Top 0.2: IC5.10 23,4.2 24.3,5.5 C6.1
N$3
  Top 0.2: MODULE1.19 34.5,19.75 34.35,19.9 RN3.3
N$4
  Top 0.2: X1.3 5,12 6.5,10.5 6.5,10 6.75,9.75 IC1.14
N$5
  Top 0.2: X1.2 5,11.35 6,10.35 6,9.75 6.5,9.25 IC1.15
N$6
  Top 0.2: C2.2 27.95,31.85 SW1.2
N$7
  Top 0.2: MODULE1.17 34.5,19.25 34.35,19.1 RN3.2
N$9
  Top 0.4: X1.1 5,10.7 5.5,10.2 5.5,6.5 8.5,3.5 F1.1
N$10
  Top 0.2: IC1.10 6.75,11.75 6.5,12 6.5,14.5 7.5,15.5 IC2.2 8.75,15.5 8.85,15.6 R1.1
N$11
  Top 0.2: IC1.11 6.5,11.25 6,11.75 6,18 7.5,19.5 IC3.2 8.75,19.5 8.85,19.6 R2.1
N$12
  Top 0.2: IC2.4 10.85,14.85 13,17 13,19.25 12.5,19.75 R3.1
N$13  (via drill 0.5)
  Top 0.2: IC3.4 v12.25,18.85 | v16.5,10.25 16.5,9 R4.1
  Bottom 0.2: v16.5,10.25 16.25,10.5 14,10.5 13,11.5 13,12.5 13.25,12.75 13.25,13.5 12,14.75 12,18.6 v12.25,18.85
N$14
  Top 1: CN4.1 10,26 C8.1 10,27 11.7,28.7 IC7.3
N$16  (via drill 0.5)
  Top 0.2: MODULE1.20 v41,19.75 | RN3.4 v34.5,20.77
  Bottom 0.2: v41,19.75 35.52,19.75 v34.5,20.77
N$17
  Top 0.2: MODULE1.11 34.5,17.75 34.02,18.23 RN3.1
N$42  (via drill 0.5)
  Top 0.2: IC1.30 14.25,11.25 v15,12 | RN1.3 27,8.65 v27,7.5
  Bottom 0.2: v15,12 15.5,11.5 24.5,11.5 27,9 v27,7.5
N$43  (via drill 0.5)
  Top 0.2: IC1.2 10.75,13.5 11,13.75 13,13.75 13.75,13 v13.75,12 | RN1.2 26,8.65 v26,7.5
  Bottom 0.2: v13.75,12 14.75,11 24.25,11 26,9.25 v26,7.5
PROGRAM  (via drill 0.5)
  Top 0.2: R6.1 v27.5,4.25 | IC4.2 v17.82,10.25 17.82,9 R4.2
  Bottom 0.2: v17.82,10.25 18.07,10.5 24,10.5 25.25,9.25 25.25,6.5 v27.5,4.25
RESET
  Top 0.2: SW1.4 27.95,33.15 C2.1 R5.1 24.25,33.15 24,32.9 24,29 23,28 21,28 20.36,27.36 IC4.21 20.36,24.36 20,24 16,24 15.5,24.5 13.75,24.5 12.5,23.25 R3.2
RING
  Top 0.2: RN3.8 30.9,18.23 28.5,15.82 IC4.10
RXD0
  Top 0.2: RN1.6 26.9,13.96 27.5,14.55 IC4.9
RXD1
  Top 0.2: RN3.6 30,19.9 29.5,19.4 29.5,18.09 28.5,17.09 IC4.11
SPI_MISO
  Top 0.2: IC5.9 23.25,3.8 23.7,4.25 R6.2
SPI_MOSI
  Top 0.2: IC5.24 16.5,3 16,3.5 16,5.5 19.09,8.6 IC4.3
SPI_SCLK  (via drill 0.5)
  Top 0.2: IC5.23 17.35,3.4 v16.75,4 | v16.75,7.5 15.75,8.5 15.75,10.7 16.55,11.5 IC4.1
  Bottom 0.2: v16.75,7.5 v16.75,4
TXD0
  Top 0.2: IC4.8 26.1,11.61 RN1.7
TXD1  (via drill 0.5)
  Top 0.2: RN3.7 v30.5,19.1 | IC4.16 v29,23.45
  Bottom 0.2: v29,23.45 29,20.6 v30.5,19.1
WAKEUP
  Top 0.2: RN3.5 30,20.77 29,19.77 29,18.86 28.5,18.36 IC4.12

### Text on the board
tNames: Wireless I2C Controller Board v1.0 | (C) 2015 anoplace Inc. | MADE IN JAPAN